# Altium schematic sheet MotorControl.SchDoc
size A4; Revision: B.2(PCB.SCH)
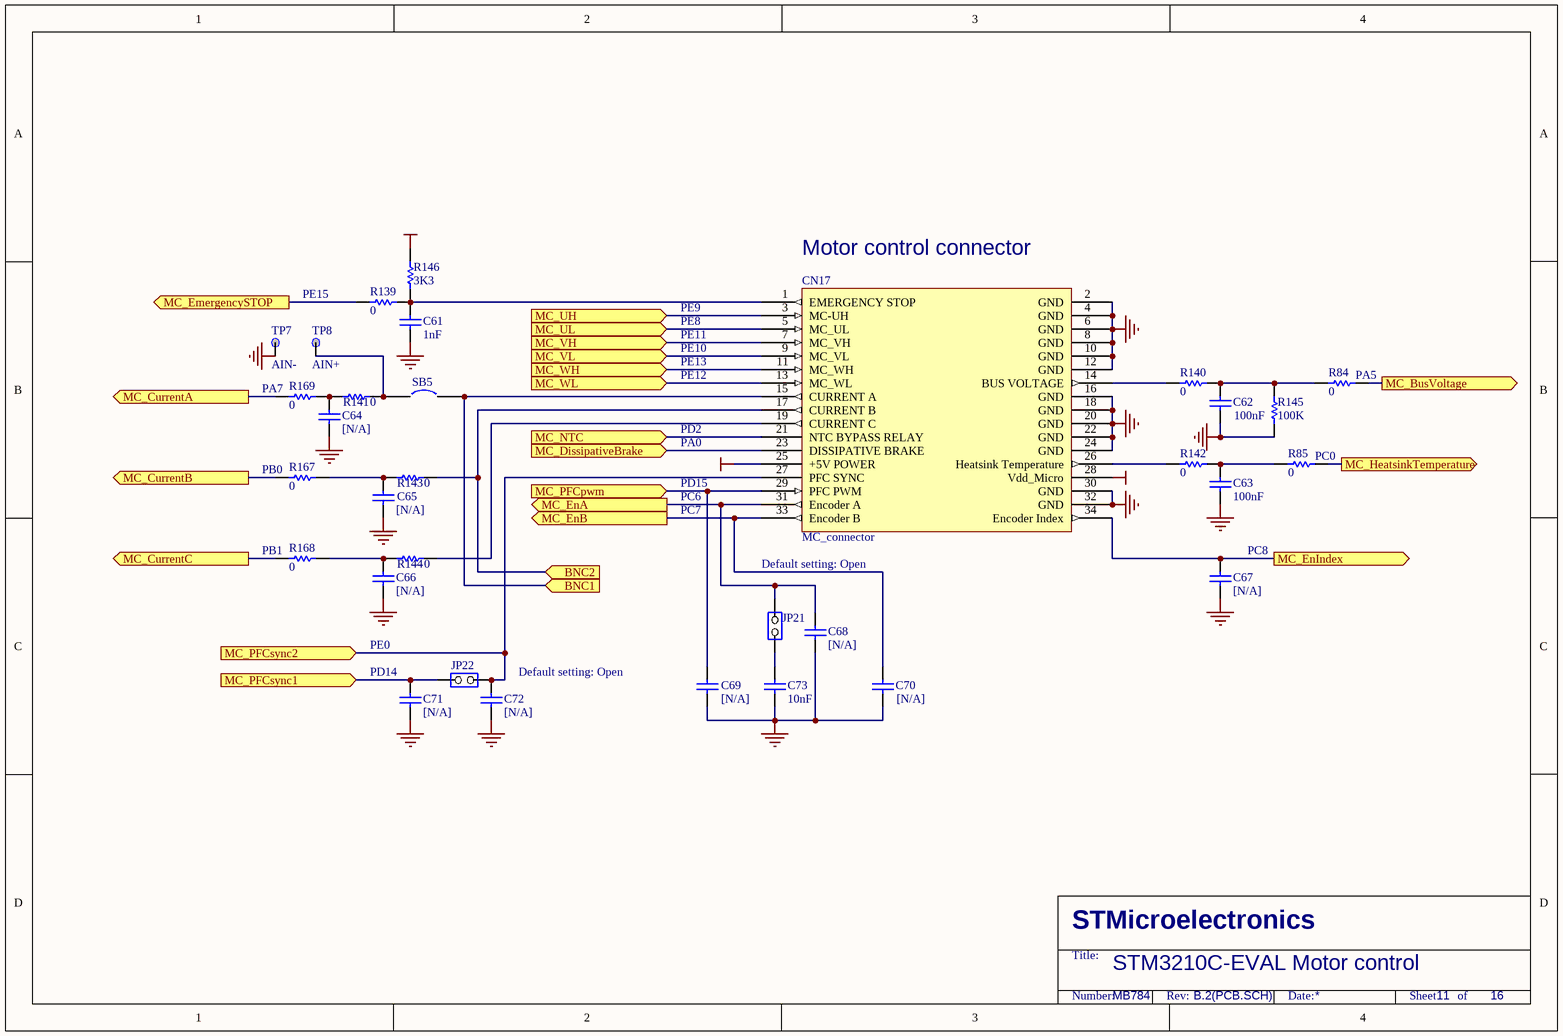
[diagram p0: MotorControl.SchDoc]

## Parts
C61  1nF  [0603C]
C62  100nF  [0603C]
C63  100nF  [0603C]
C64  [N/A]  [0603C]
C65  [N/A]  [0603C]
C66  [N/A]  [0603C]
C67  [N/A]  [0603C]
C68  [N/A]  [0603C]
C69  [N/A]  [0603C]
C70  [N/A]  [0603C]
C71  [N/A]  [0603C]
C72  [N/A]  [0603C]
C73  10nF  [0603C]
CN17  MC_connector  [IDC34S]
JP21  (no value)  [SIP2]
JP22  (no value)  [SIP2]
R84  0  [0603R]
R85  0  [0603R]
R139  0  [0603R]
R140  0  [0603R]
R141  0  [0603R]
R142  0  [0603R]
R143  0  [0603R]
R144  0  [0603R]
R145  100K  [0603R]
R146  3K3  [0603R]
R167  0  [0603R]
R168  0  [0603R]
R169  0  [0603R]
SB5  (no value)  [JP2_SMD]
TP7  AIN-  [TP]
TP8  AIN+  [TP]

## Ports
BNC1 (in), BNC2 (in), MC_BusVoltage (out), MC_CurrentA (out), MC_CurrentB (out), MC_CurrentC (out), MC_DissipativeBrake (in), MC_EmergencySTOP (out), MC_EnA (out), MC_EnB (out), MC_EnIndex (out), MC_HeatsinkTemperature (out), MC_NTC (in), MC_PFCpwm (in), MC_PFCsync1 (in), MC_PFCsync2 (in), MC_UH (in), MC_UL (in), MC_VH (in), MC_VL (in), MC_WH (in), MC_WL (in)

## Nets
+3V3: CN17.28(Vdd_Micro) R146.2
+5V: CN17.25(+5V_POWER)
GND: C61.1 C62.1 C63.1 C64.1 C65.1 C66.1 C67.1 C68.1 C69.1 C70.1 C71.1 C72.1 C73.1 CN17.2(GND) CN17.4(GND) CN17.6(GND) CN17.8(GND) CN17.10(GND) CN17.12(GND) CN17.16(GND) CN17.18(GND) CN17.20(GND) CN17.22(GND) CN17.24(GND) CN17.30(GND) CN17.32(GND) R145.1 TP7.1
BNC1: CN17.15(CURRENT_A) SB5.2 ; port BNC1
BNC2: CN17.17(CURRENT_B) R143.2 ; port BNC2
MC_BusVoltage: R84.2 ; port MC_BusVoltage
MC_CurrentA: R169.1 ; port MC_CurrentA
MC_CurrentB: R167.1 ; port MC_CurrentB
MC_CurrentC: R168.1 ; port MC_CurrentC
MC_DissipativeBrake: CN17.23(DISSIPATIVE_BRAKE) ; port MC_DissipativeBrake
MC_EmergencySTOP: R139.2 ; port MC_EmergencySTOP
MC_EnA: C68.2 CN17.31(Encoder_A) JP21.1(COMMON) ; port MC_EnA
MC_EnB: C70.2 CN17.33(Encoder_B) ; port MC_EnB
MC_EnIndex: C67.2 CN17.34(Encoder_Index) ; port MC_EnIndex
MC_HeatsinkTemperature: R85.2 ; port MC_HeatsinkTemperature
MC_NTC: CN17.21(NTC_BYPASS_RELAY) ; port MC_NTC
MC_PFCpwm: C69.2 CN17.29(PFC_PWM) ; port MC_PFCpwm
MC_PFCsync1: C71.2 JP22.2(NO) ; port MC_PFCsync1
MC_PFCsync2: C72.2 CN17.27(PFC_SYNC) JP22.1(COMMON) ; port MC_PFCsync2
MC_UH: CN17.3(MC-UH) ; port MC_UH
MC_UL: CN17.5(MC_UL) ; port MC_UL
MC_VH: CN17.7(MC_VH) ; port MC_VH
MC_VL: CN17.9(MC_VL) ; port MC_VL
MC_WH: CN17.11(MC_WH) ; port MC_WH
MC_WL: CN17.13(MC_WL) ; port MC_WL
NetC61_2: C61.2 CN17.1(EMERGENCY_STOP) R139.1 R146.1
NetC62_2: C62.2 R84.1 R140.2 R145.2
NetC63_2: C63.2 R85.1 R142.2
NetC64_2: C64.2 R141.1 R169.2
NetC65_2: C65.2 R143.1 R167.2
NetC66_2: C66.2 R144.1 R168.2
NetC73_2: C73.2 JP21.2(NO)
NetCN17_14: CN17.14(BUS_VOLTAGE) R140.1
NetCN17_19: CN17.19(CURRENT_C) R144.2
NetCN17_26: CN17.26(Heatsink_Temperature) R142.1
NetR141_2: R141.2 SB5.1 TP8.1

## Notes on the sheet
- PE15
- PE9
- (near CN17) Motor control connector
- PE8
- PE11
- PE10
- PE13
- PE12
- (near R84) PA5
- (near R169) PA7
- PD2
- PA0
- (near R167) PB0
- PD15
- PC6
- PC7
- (near R85) PC0
- (near R168) PB1
- Default setting: Open
- (near C67) PC8
- PE0
- (near C71) PD14
- (near C72) Default setting: Open
- STM3210C-EVAL Motor control
- MB784
- 11
- 16
- STMicroelectronics
- Title:
- Number:
- Rev:
- Date:
- Sheet       of

## Library data of the parts
C61 = CAP: Capacitor; Value: 100pF; Published: 8-Jun-2000; Revision: July-2002: Re-released for DXP Platform.; Publisher: Altium Limited
C62-C73 = cap: Capacitor; Value: 100pF; Published: 8-Jun-2000; Revision: July-2002: Re-released for DXP Platform.; Publisher: Altium Limited
JP21 JP22 = JP2
R84 R85 R139-R146 R167-R169 = Res1: Resistor; Value: 1K; Published: 8-Jun-2000; Revision: July-2002: Re-released for DXP Platform.; Publisher: Altium Limited
SB5 = Circuit Breaker: Published: 24-Mar-1999; Revision: July-2002: Re-released for DXP Platform.; Publisher: Altium Limited
TP7 TP8 = TP